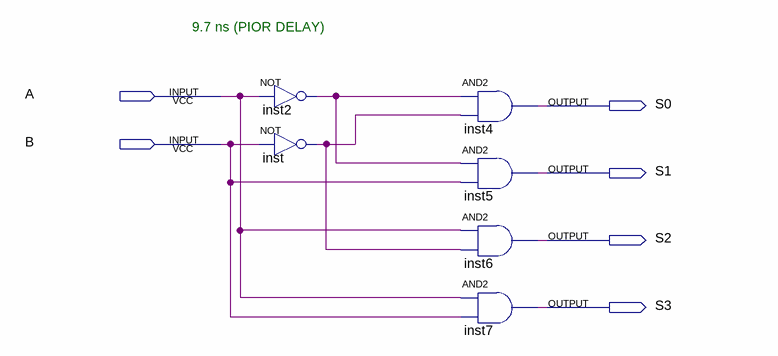
[diagram p0: schematic sheet]
// Quartus schematic DECODER2_4.bdf as structural Verilog: 6 symbols, 6 pins
module DECODER2_4 (
  input  A,
  input  B,
  output S0,
  output S1,
  output S2,
  output S3
);

  wire inst2_out, inst_out;

  not inst2 (inst2_out, A);
  not inst (inst_out, B);
  and inst4 (S0, inst2_out, inst_out);
  and inst5 (S1, inst2_out, B);
  and inst6 (S2, A, inst_out);
  and inst7 (S3, A, B);

  // Notes on the sheet:
  //   9.7 ns (PIOR DELAY)
endmodule
